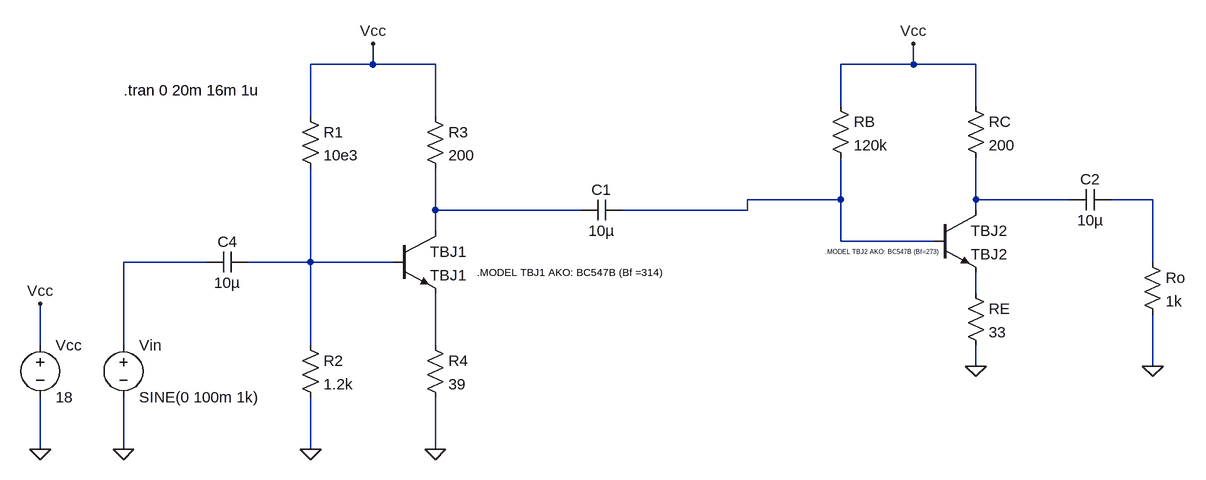
[diagram p0: schematic tbj_amplificador_teorico.asc]
tbj_amplificador_teorico.asc, the LTspice schematic file:
Version 4
SHEET 1 880 804
WIRE -768 -48 -768 -80
WIRE -768 -48 -864 -48
WIRE -672 -48 -768 -48
WIRE 64 -48 64 -80
WIRE 64 -48 -48 -48
WIRE 160 -48 64 -48
WIRE -48 16 -48 -48
WIRE 160 16 160 -48
WIRE -864 32 -864 -48
WIRE -672 32 -672 -48
WIRE -48 160 -48 96
WIRE -48 160 -192 160
WIRE 160 160 160 96
WIRE 304 160 160 160
WIRE 432 160 368 160
WIRE -672 176 -672 112
WIRE -448 176 -672 176
WIRE -192 176 -192 160
WIRE -192 176 -384 176
WIRE 160 176 160 160
WIRE -672 208 -672 176
WIRE -48 224 -48 160
WIRE 96 224 -48 224
WIRE -1024 256 -1152 256
WIRE -864 256 -864 112
WIRE -864 256 -960 256
WIRE -736 256 -864 256
WIRE 432 256 432 160
WIRE 160 304 160 272
WIRE -1280 384 -1280 320
WIRE -1152 384 -1152 256
WIRE -864 384 -864 256
WIRE -672 384 -672 304
WIRE 160 416 160 384
WIRE 432 416 432 336
WIRE -1280 544 -1280 464
WIRE -1152 544 -1152 464
WIRE -864 544 -864 464
WIRE -672 544 -672 464
FLAG -1280 544 0
FLAG -1152 544 0
FLAG 432 416 0
FLAG 160 416 0
FLAG -1280 320 Vcc
FLAG 64 -80 Vcc
FLAG -864 544 0
FLAG -672 544 0
FLAG -768 -80 Vcc
SYMBOL voltage -1280 368 R0
WINDOW 123 0 0 Left 0
WINDOW 39 0 0 Left 0
SYMATTR InstName Vcc
SYMATTR Value 18
SYMBOL voltage -1152 368 R0
WINDOW 123 0 0 Left 0
WINDOW 39 0 0 Left 0
SYMATTR InstName Vin
SYMATTR Value SINE(0 100m 1k)
SYMBOL res -64 0 R0
SYMATTR InstName RB
SYMATTR Value 120k
SYMBOL res 144 0 R0
SYMATTR InstName RC
SYMATTR Value 200
SYMBOL res 144 288 R0
SYMATTR InstName RE
SYMATTR Value 33
SYMBOL npn 96 176 R0
SYMATTR InstName TBJ2
SYMATTR Value TBJ2
SYMBOL res 416 240 R0
SYMATTR InstName Ro
SYMATTR Value 1k
SYMBOL cap 368 144 R90
WINDOW 0 0 32 VBottom 2
WINDOW 3 32 32 VTop 2
SYMATTR InstName C2
SYMATTR Value 10µ
SYMBOL cap -960 240 R90
WINDOW 0 0 32 VBottom 2
WINDOW 3 32 32 VTop 2
SYMATTR InstName C4
SYMATTR Value 10µ
SYMBOL res -880 16 R0
SYMATTR InstName R1
SYMATTR Value 10e3
SYMBOL res -880 368 R0
SYMATTR InstName R2
SYMATTR Value 1.2k
SYMBOL res -688 16 R0
SYMATTR InstName R3
SYMATTR Value 200
SYMBOL res -688 368 R0
SYMATTR InstName R4
SYMATTR Value 39
SYMBOL npn -736 208 R0
SYMATTR InstName TBJ1
SYMATTR Value TBJ1
SYMBOL cap -384 160 R90
WINDOW 0 0 32 VBottom 2
WINDOW 3 32 32 VTop 2
SYMATTR InstName C1
SYMATTR Value 10µ
TEXT -72 240 Left 0 !.MODEL TBJ2 AKO: BC547B (Bf=273)
TEXT -1152 -8 Left 2 !.tran 0 20m 16m 1u
TEXT -608 272 Left 1 !.MODEL TBJ1 AKO: BC547B (Bf =314)

The netlist it stands for:
* tbj_amplificador_teorico.asc
Vcc Vcc 0 18
Vin N005 0 SINE(0 100m 1k)
RB Vcc N001 120k
RC Vcc N002 200
RE N007 0 33
Q§TBJ2 N002 N001 N007 0 TBJ2
Ro N003 0 1k
C2 N003 N002 10µ
C4 N006 N005 10µ
R1 Vcc N006 10e3
R2 N006 0 1.2k
R3 Vcc N004 200
R4 N008 0 39
Q§TBJ1 N004 N006 N008 0 TBJ1
C1 N001 N004 10µ
.model NPN NPN
.model PNP PNP
.lib standard.bjt
.MODEL TBJ2 AKO: BC547B (Bf=273)
.tran 0 20m 16m 1u
.MODEL TBJ1 AKO: BC547B (Bf =314)
.backanno
.end